# EAGLE design RPi0PWR (EAGLE 9.6.2)
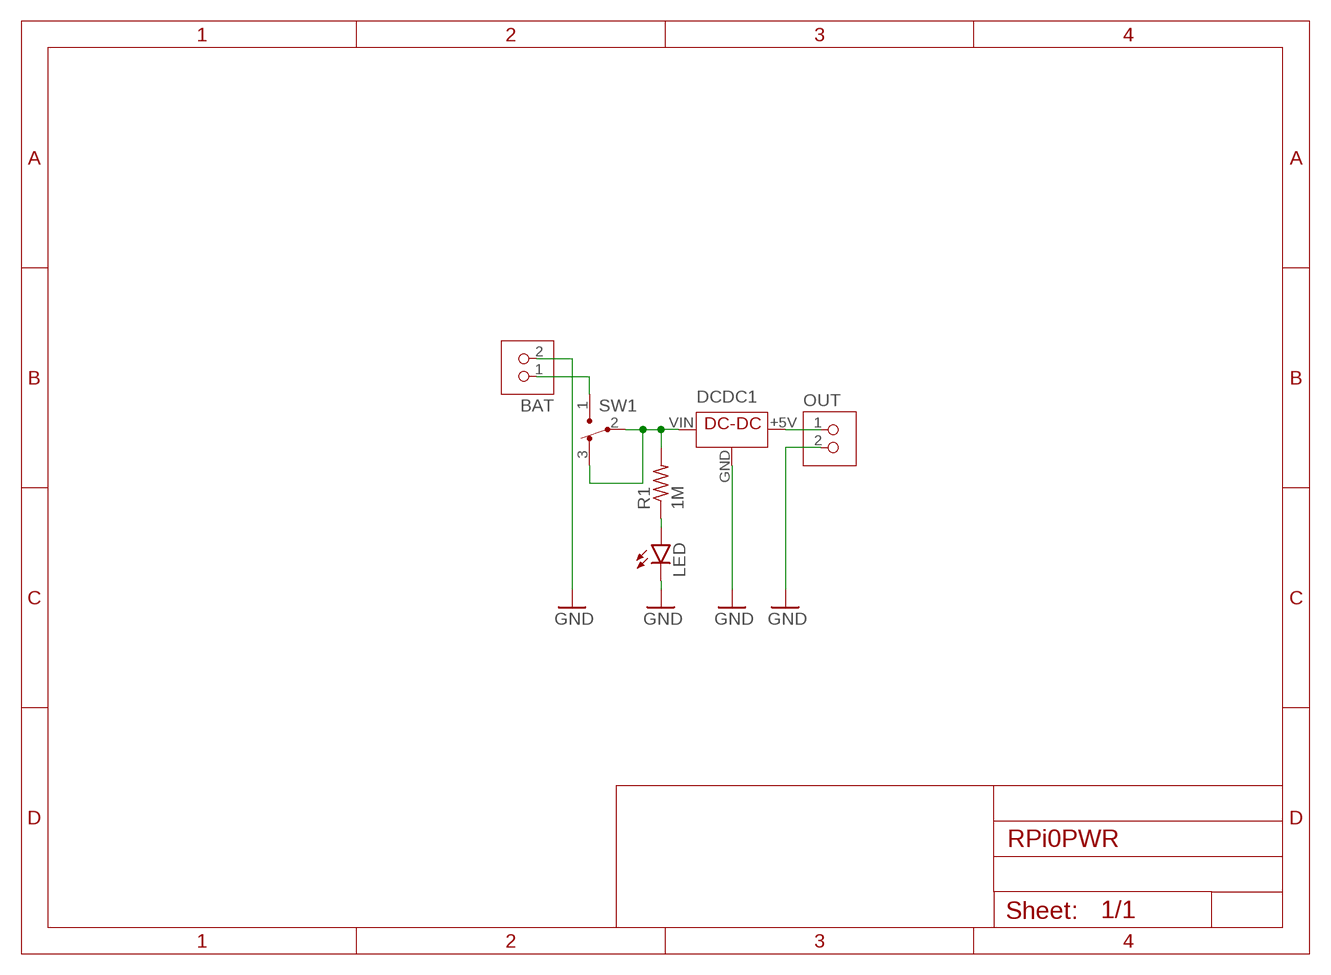
[diagram p0: schematic, sheet 1]

## Parts
BAT  JST-PH2  [JST-PH2]
DCDC1  DCDC-5V-0.48A  [DCDC-5V-0.48A]
LED  LED3MM  [LED3MM]
OUT  JST-PH2  [JST-PH2]
R1  1M  R-US_0204/5  [0204/5]
SW1  SW3-1  [SW3-1]

## Nets
BAT+: DCDC1.VIN R1.2 SW1.2 SW1.3
GND: BAT.2 DCDC1.GND LED.K(C) OUT.2
LED+: LED.A R1.1
N$1: DCDC1.+5V(VOUT) OUT.1
N$2: BAT.1 SW1.1

## Library data of the parts
BAT OUT = ytani1:JST-PH2
DCDC1 = ytani1:DCDC-5V-0.48A: DC-DC step up converter T64 https://www.amazon.co.jp/gp/product/B07N8TBJB3/ Vin: 0.9V-5V Vout: 5V; URL_AMAZON: https://www.amazon.co.jp/gp/product/B07N8TBJB3/
LED = led:LED: LED OSRAM: - CHIPLED LG R971, LG N971, LY N971, LG Q971, LY Q971, LO R971, LY R971 LH N974, LH R974 LS Q976, LO Q976, LY Q976 LO Q996 - Hyper CHIPLED LW Q18S LB Q993, LB Q99A, LB R99A - SideLED LS A670, LO A670, LY A670, LG A670, LP A670 LB A673, LV A673, LT A673, LW A673 LH A674 LY A675 LS A676, LA A676, LO A676, LY A676, LW A676 LS A679, LY A679, LG A679 - Hyper Micro SIDELED® LS Y876, LA Y876, LO Y876, LY Y876 LT Y87S - SmartLED LW L88C, LW L88S LB L89C, LB L89S, LG L890 LS L89K, LO L89K, LY L89K LS L896, LA L896, LO L896, LY L896 - TOPLED LS T670, LO T670, LY T670, LG T670, LP T670 LSG T670, LSP T670, LSY T670, LOP T670, LYG T670 LG T671, LOG T671, LSG T671 LB T673, LV T673, LT T673, LW T673 LH T674 LS T676, LA T676, LO T676, LY T676, LB T676, LH T676, LSB T676, LW T676 LB T67C, LV T67C, LT T67C, LS T67K, LO T67K, LY T67K, LW E67C LS E67B, LA E67B, LO E67B, LY E67B, LB E67C, LV E67C, LT E67C LW T67C LS T679, LY T679, LG T679 LS T770, LO T770, LY T770, LG T770, LP T770 LB T773, LV T773, LT T773, LW T773 LH T774 LS E675, LA E675, LY E675, LS T675 LS T776, LA T776, LO T776, LY T776, LB T776 LHGB T686 LT T68C, LB T68C - Hyper Mini TOPLED® LB M676 - Mini TOPLED Santana® LG M470 LS M47K, LO M47K, LY M47K Source: http://www.osram.convergy.de LUXEON: - LUMILED® LXK2-PW12-R00, LXK2-PW12-S00, LXK2-PW14-U00, LXK2-PW14-V00 LXK2-PM12-R00, LXK2-PM12-S00, LXK2-PM14-U00 LXK2-PE12-Q00, LXK2-PE12-R00, LXK2-PE12-S00, LXK2-PE14-T00, LXK2-PE14-U00 LXK2-PB12-K00, LXK2-PB12-L00, LXK2-PB12-M00, LXK2-PB14-N00, LXK2-PB14-P00, LXK2-PB14-Q00 LXK2-PR12-L00, LXK2-PR12-M00, LXK2-PR14-Q00, LXK2-PR14-R00 LXK2-PD12-Q00, LXK2-PD12-R00, LXK2-PD12-S00 LXK2-PH12-R00, LXK2-PH12-S00 LXK2-PL12-P00, LXK2-PL12-Q00, LXK2-PL12-R00 Source: www.luxeon.com KINGBRIGHT: KA-3528ASYC Source: www.kingbright.com
R1 = rcl:R-US_: RESISTOR, American symbol; SPICEPREFIX: R
SW1 = ytani1:SW3-1: Slide Switch 3x1 pin https://www.amazon.co.jp/gp/product/B01LYVYQNO/ SS12D00G3 2ポジションSPDT 1P2T 3ピン; MF: HiLetgo; URL_AMAZON: https://www.amazon.co.jp/gp/product/B01LYVYQNO/

## Board
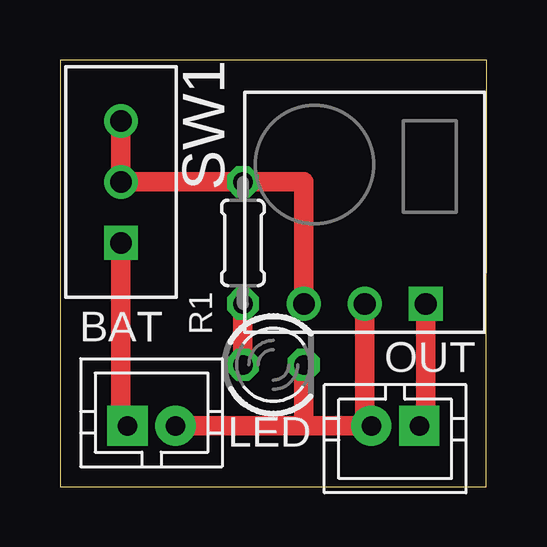
[diagram p1: board, top side]

Size 17.78 x 17.78 mm. Coordinates in mm from the lower left corner, seen from the top.
Outline: 0,0 17.76,0 17.78,17.78 0,17.78 0,0
Copper layers (1*16): Top 0.035mm / dielectric 1.5mm / Bottom 0.035mm
Design rules "SeeedStudio_2layer_DRU_no_angle_20140221": minimum track width 6mil, minimum drill 12mil, track to track 6mil, track to pad 6mil, pad to pad 6mil, via to via 6mil, smd to smd 0mil, copper to edge 10mil, drill to drill 10mil, minimum pad ring 10mil, minimum via ring 6mil, stop-mask expansion 2mil, vias tented up to drill 100mil, thermal gap 10mil

### Footprints (pad centres in the part's own frame; a part is rotated, then mirrored left to right if it is on the bottom)
JST-PH2 = drill 0.813 pad 1.676 square: 1 -1,0 | drill 0.813 pad 1.676: 2 1,0
DCDC-5V-0.48A = drill 0.9 square: +5V -2.54,3.81 | drill 0.9: GND 0,3.81; VIN 2.54,3.81
LED3MM = drill 0.813 octagon: A -1.27,0; K 1.27,0
0204/5 = drill 0.813 octagon: 1 -2.54,0; 2 2.54,0
SW3-1 = drill 0.9 square: 1 -2.54,0 | drill 0.9: 2 0,0; 3 2.54,0

### Placement (x,y rotation side)
BAT  3.81,2.54 0 top
DCDC1  12.7,11.43 180 top
LED  8.89,5.08 0 top
OUT  13.97,2.54 180 top
R1  7.62,10.16 90 top
SW1  2.54,12.7 90 top

### Tracks (layer width: path | path; a pad name or v marks a point on that pad's centre or on a via)
BAT+
  Top 0.813: SW1.3 SW1.2 R1.2 10.16,12.7 DCDC1.VIN
GND
  Top 0.813: 10.16,2.54 12.7,2.54 | 12.7,2.54 OUT.2 | LED.K 10.16,2.54 | BAT.2 10.16,2.54 | DCDC1.GND 12.7,2.54
LED+
  Top 0.813: LED.A R1.1
N$1
  Top 0.813: DCDC1.+5V 15.24,2.54 OUT.1
N$2
  Top 0.813: SW1.1 2.54,2.54 BAT.1